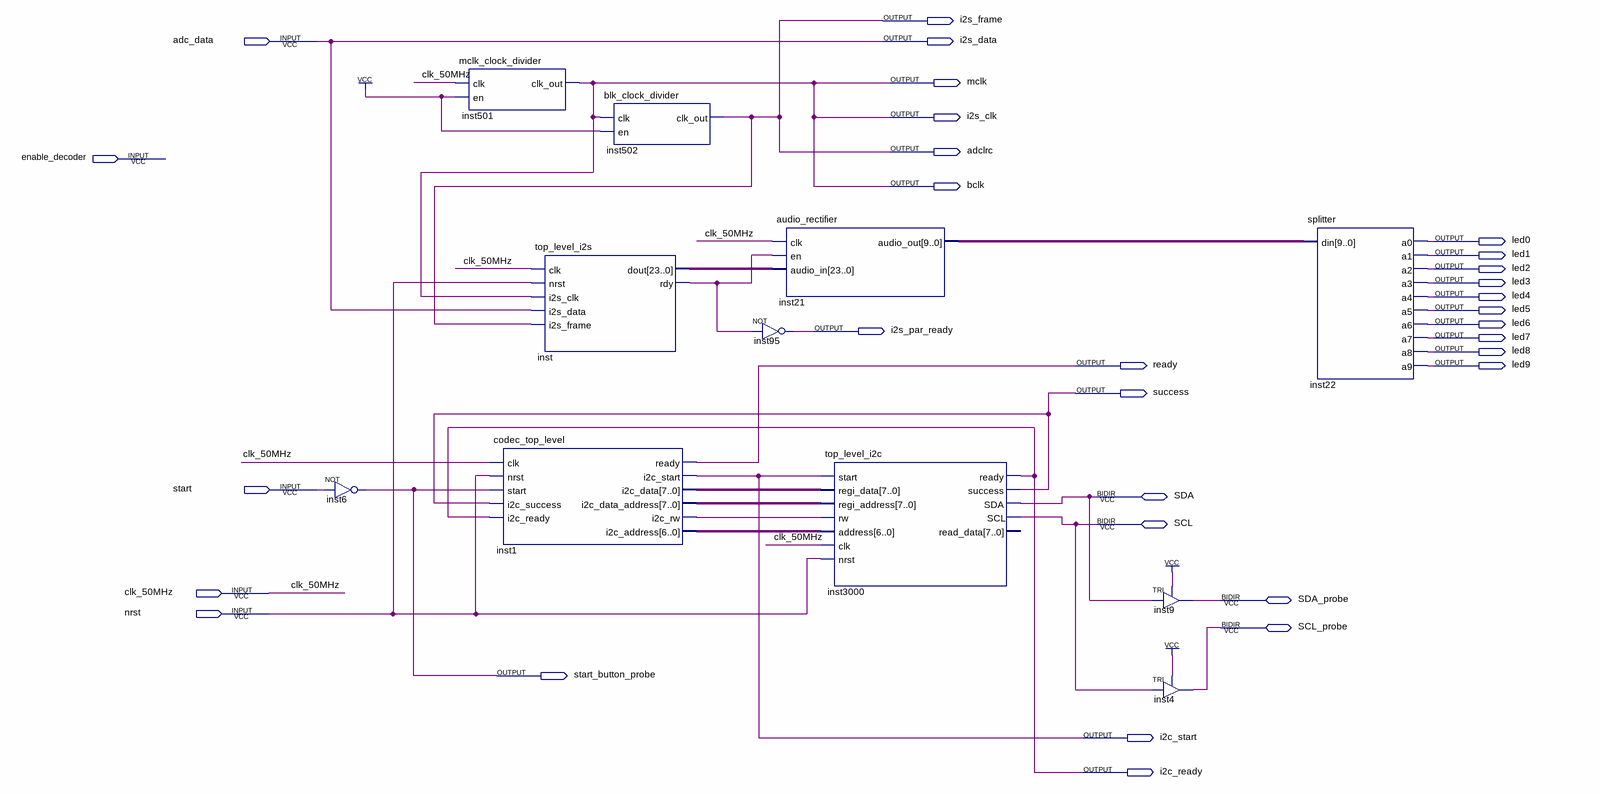
[diagram p0: schematic sheet]
// Quartus schematic i2c_configurator.bdf as structural Verilog: 11 symbols, 31 pins
module i2c_configurator (
  input  adc_data,
  input  enable_decoder,
  input  start,
  input  clk_50MHz,
  input  nrst,
  inout  SDA,
  inout  SCL,
  inout  SDA_probe,
  inout  SCL_probe,
  output i2s_frame,
  output i2s_data,
  output mclk,
  output i2s_clk,
  output adclrc,
  output bclk,
  output led0,
  output led1,
  output led2,
  output led3,
  output led4,
  output led5,
  output led6,
  output i2s_par_ready,
  output led7,
  output led8,
  output ready,
  output led9,
  output success,
  output start_button_probe,
  output i2c_start,
  output i2c_ready
);

  wire inst1_i2c_rw, inst_rdy;
  wire [6:0] inst1_i2c_address;
  wire [7:0] inst1_i2c_data, inst1_i2c_data_address;
  wire [9:0] inst21_audio_out;
  wire [23:0] inst_dout;

  not inst6 (start_button_probe, start);
  mclk_clock_divider inst501 (.clk(clk_50MHz), .en(1'b1), .clk_out(bclk));
  codec_top_level inst1 (
    .clk(clk_50MHz), .nrst(nrst), .start(start_button_probe), .i2c_success(success), .i2c_ready(i2c_ready),
    .ready(ready), .i2c_start(i2c_start), .i2c_address(inst1_i2c_address), .i2c_rw(inst1_i2c_rw),
    .i2c_data(inst1_i2c_data), .i2c_data_address(inst1_i2c_data_address));
  top_level_i2s inst (
    .clk(clk_50MHz), .nrst(nrst), .i2s_clk(bclk), .i2s_data(adc_data), .i2s_frame(adclrc), .dout(inst_dout),
    .rdy(inst_rdy));
  blk_clock_divider inst502 (.clk(bclk), .en(1'b1), .clk_out(adclrc));
  audio_rectifier inst21 (.clk(clk_50MHz), .en(inst_rdy), .audio_in(inst_dout), .audio_out(inst21_audio_out));
  not inst95 (i2s_par_ready, inst_rdy);
  top_level_i2c inst3000 (
    .start(i2c_start), .regi_data(inst1_i2c_data), .regi_address(inst1_i2c_data_address), .rw(inst1_i2c_rw),
    .address(inst1_i2c_address), .clk(clk_50MHz), .nrst(nrst), .ready(i2c_ready), .success(success),
    .SDA(SDA), .SCL(SCL));  // open: read_data
  TRI inst9 (.IN(SDA), .OE(1'b1), .OUT(SDA_probe));
  TRI inst4 (.IN(SCL), .OE(1'b1), .OUT(SCL_probe));
  splitter inst22 (
    .din(inst21_audio_out), .a0(led0), .a1(led1), .a2(led2), .a3(led3), .a4(led4), .a5(led5), .a6(led6),
    .a7(led7), .a8(led8), .a9(led9));

  assign i2s_clk = bclk;
  assign i2s_data = adc_data;
  assign i2s_frame = adclrc;
  assign mclk = bclk;
endmodule
